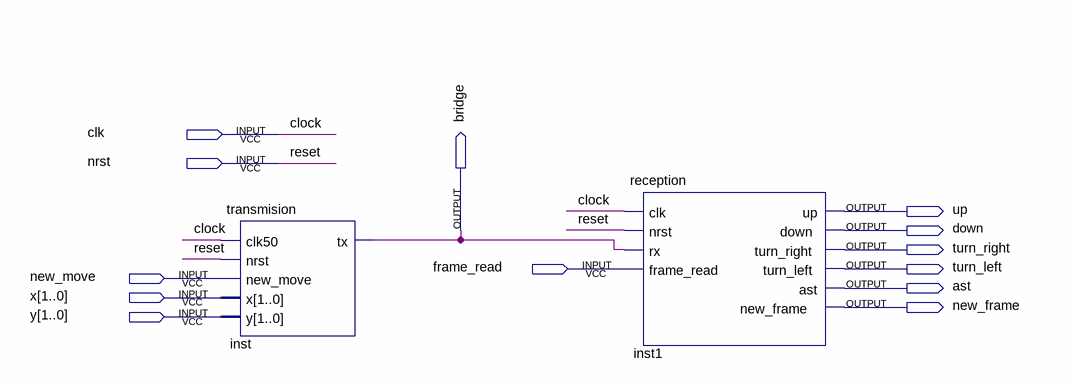
[diagram p0: schematic sheet]
// Quartus schematic tx_rx.bdf as structural Verilog: 2 symbols, 13 pins
module tx_rx (
  input  clk,
  input  nrst,
  input  frame_read,
  input  new_move,
  input  [1:0] x,
  input  [1:0] y,
  output up,
  output bridge,
  output down,
  output turn_right,
  output turn_left,
  output ast,
  output new_frame
);

  transmision inst (.clk50(clk), .nrst(nrst), .new_move(new_move), .x(x), .y(y), .tx(bridge));
  reception inst1 (
    .clk(clk), .nrst(nrst), .rx(bridge), .frame_read(frame_read), .up(up), .down(down),
    .turn_right(turn_right), .turn_left(turn_left), .ast(ast), .new_frame(new_frame));

  // Other names for the same wires on the sheet: clock = clk; reset = nrst
endmodule
